# EAGLE design Rev 1 (EAGLE 7.2.0)
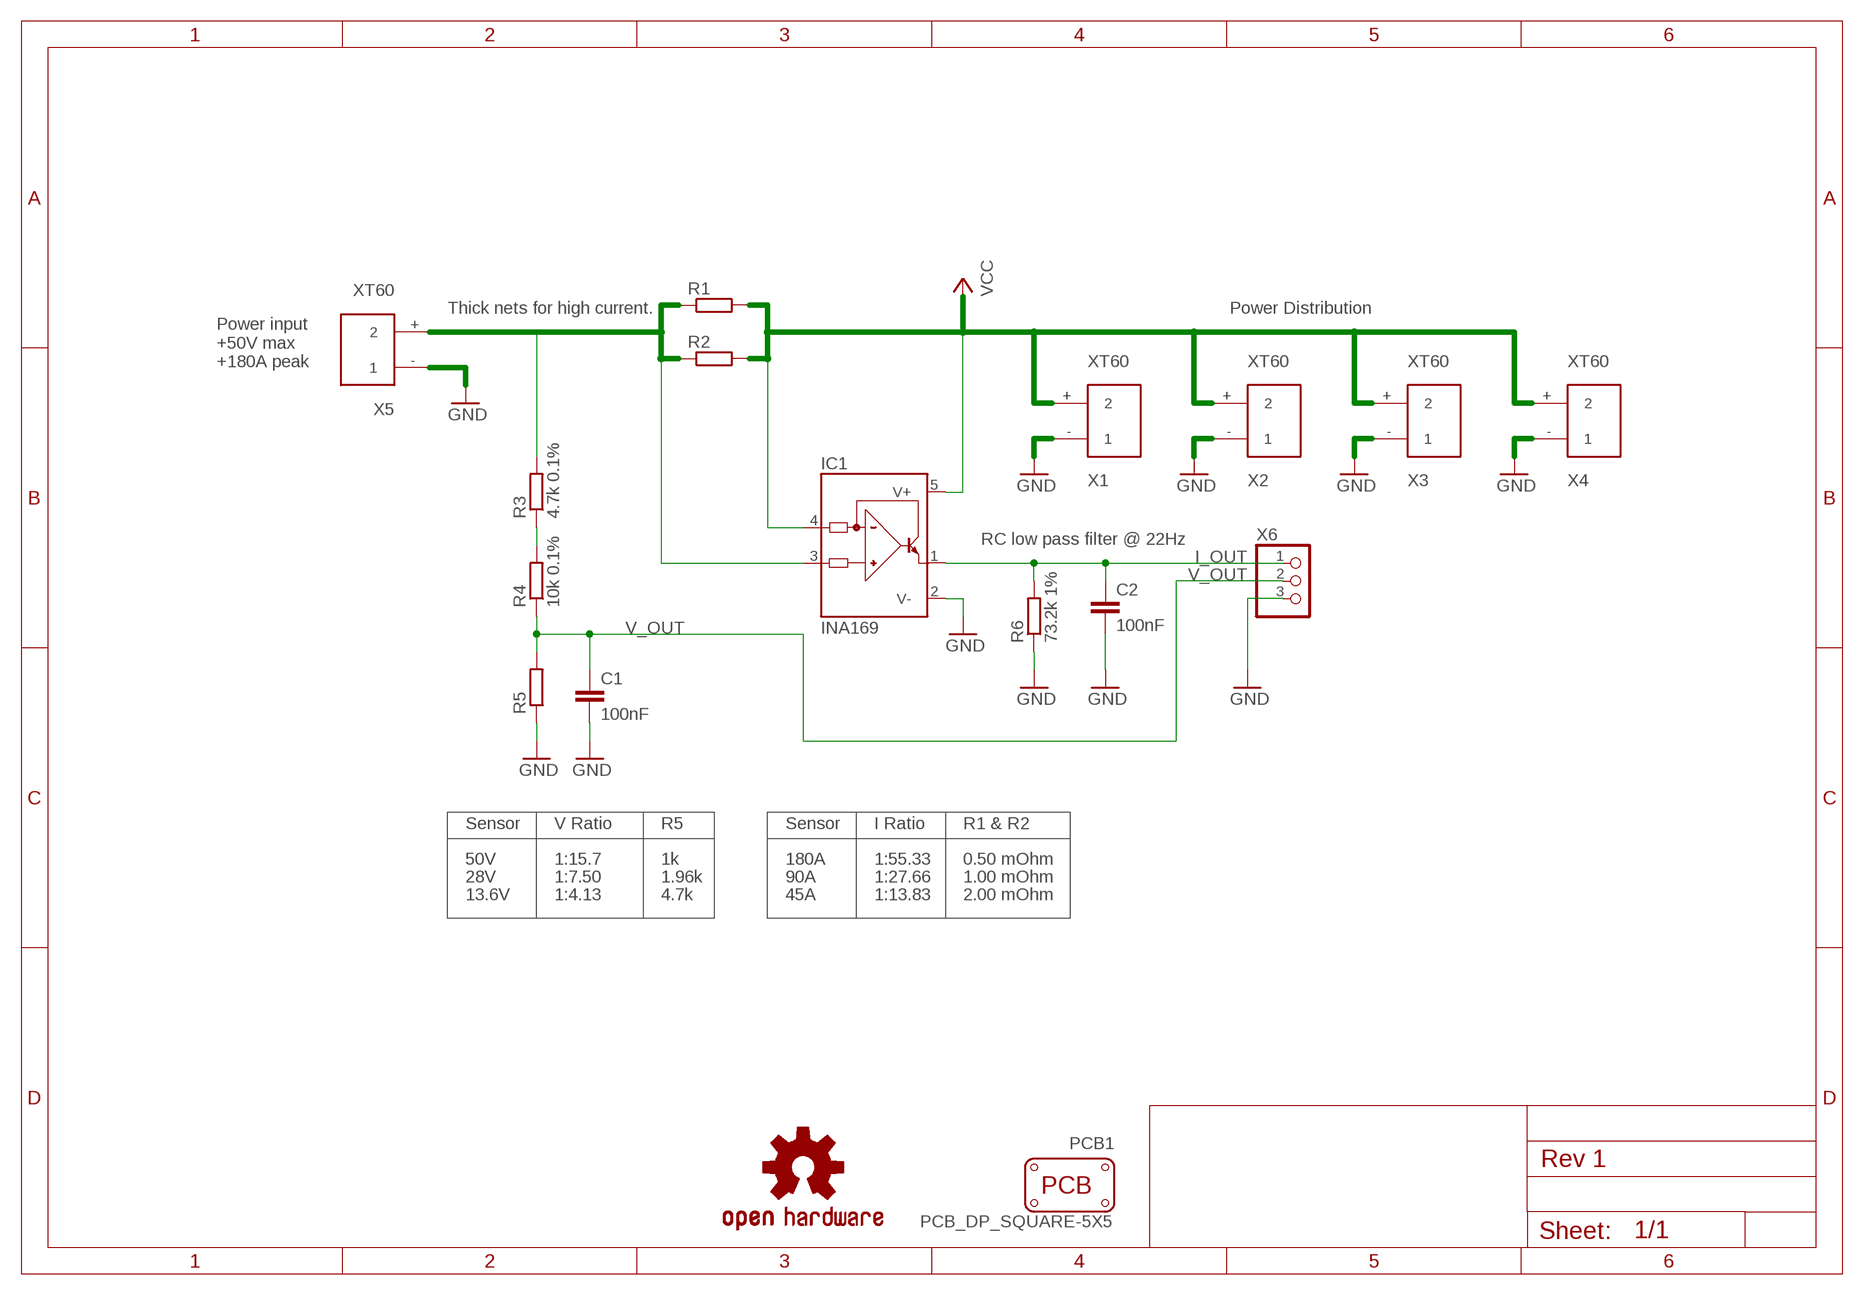
[diagram p0: schematic, sheet 1]

## Parts
C1  100nF  C-EUC0805  [C0805]
C2  100nF  C-EUC0805  [C0805]
IC1  INA169  INA168  [SOT23-5]
LOGO1  OSHW-LOGOL  [OSHW-LOGO-L]
PCB1  PCB_DP_SQUARE-5X5  [DP5050_V1]
R1  R-EU_R2512  [R2512]
R2  R-EU_R2512  [R2512]
R3  4.7k 0.1%  R-EU_R0805  [R0805]
R4  10k 0.1%  R-EU_R0805  [R0805]
R5  R-EU_R0805  [R0805]
R6  73.2k 1%  R-EU_R0805  [R0805]
X1  XT60  [XT60]
X2  XT60  [XT60]
X3  XT60  [XT60]
X4  XT60  [XT60]
X5  XT60  [XT60]
X6  PINHD-1X3  [1X03]

## Nets
GND: C1.2 C2.2 IC1.2(V-) R5.1 R6.1 X1.- X2.- X3.- X4.- X5.- X6.3
I_OUT: C2.1 IC1.1(OUT) R6.2 X6.1
V_OUT: C1.1 R4.1 R5.2 X6.2
V_SEN_HIGH: R3.1 R4.2
VCC: IC1.4(IN-) IC1.5(V+) R1.2 R2.2 X1.+ X2.+ X3.+ X4.+
VCC_RAW: IC1.3(IN+) R1.1 R2.1 R3.2 X5.+

## Notes on the sheet
- Thick nets for high current. | Power Distribution
- Power input
  +50V max
  +180A peak
- RC low pass filter @ 22Hz
- Sensor | V Ratio | R5 | Sensor | I Ratio | R1 & R2
- 50V | 1:15.7 | 1k | 180A | 1:55.33 | 0.50 mOhm
- 28V | 1:7.50 | 1.96k | 90A | 1:27.66 | 1.00 mOhm
- 13.6V | 1:4.13 | 4.7k | 45A | 1:13.83 | 2.00 mOhm

## Library data of the parts
C1 C2 = rcl:C-EU: CAPACITOR, European symbol; MF: AVX; MPN: 02016D104KAT2A; OC_FARNELL: 1657913
IC1 = burr-brown:INA168: High-Side Measurement Current Shunt Monitor; MF: TEXAS INSTRUMENTS; MPN: INA169NA/250G4; OC_FARNELL: 1234749
LOGO1 = SparkFun-Aesthetics:OSHW-LOGO: Open Source Hardware Logo This logo indicates the piece of hardware it is found on incorporates a OSHW license and/or adheres to the definition of open source hardware found here: http://freedomdefined.org/OSHW; OC_FARNELL: unknown
PCB1 = dp_devices:PCB_DP_SQUARE: Dangerous Prototypes Standard Square PCB sizes; OC_FARNELL: unknown
R1 R2 R5 R6 = rcl:R-EU_: RESISTOR, European symbol; OC_FARNELL: unknown
R3 = rcl:R-EU_: RESISTOR, European symbol; MF: SUSUMU; MPN: RR1220P-472-B-T5; OC_FARNELL: 1653308
R4 = rcl:R-EU_: RESISTOR, European symbol; MF: SUSUMU; MPN: RR1220P-103-B-T5; OC_FARNELL: 1653282
X1-X5 = general:XT60; OC_FARNELL: unknown
X6 = pinhead:PINHD-1X3: PIN HEADER; OC_FARNELL: unknown

## Board
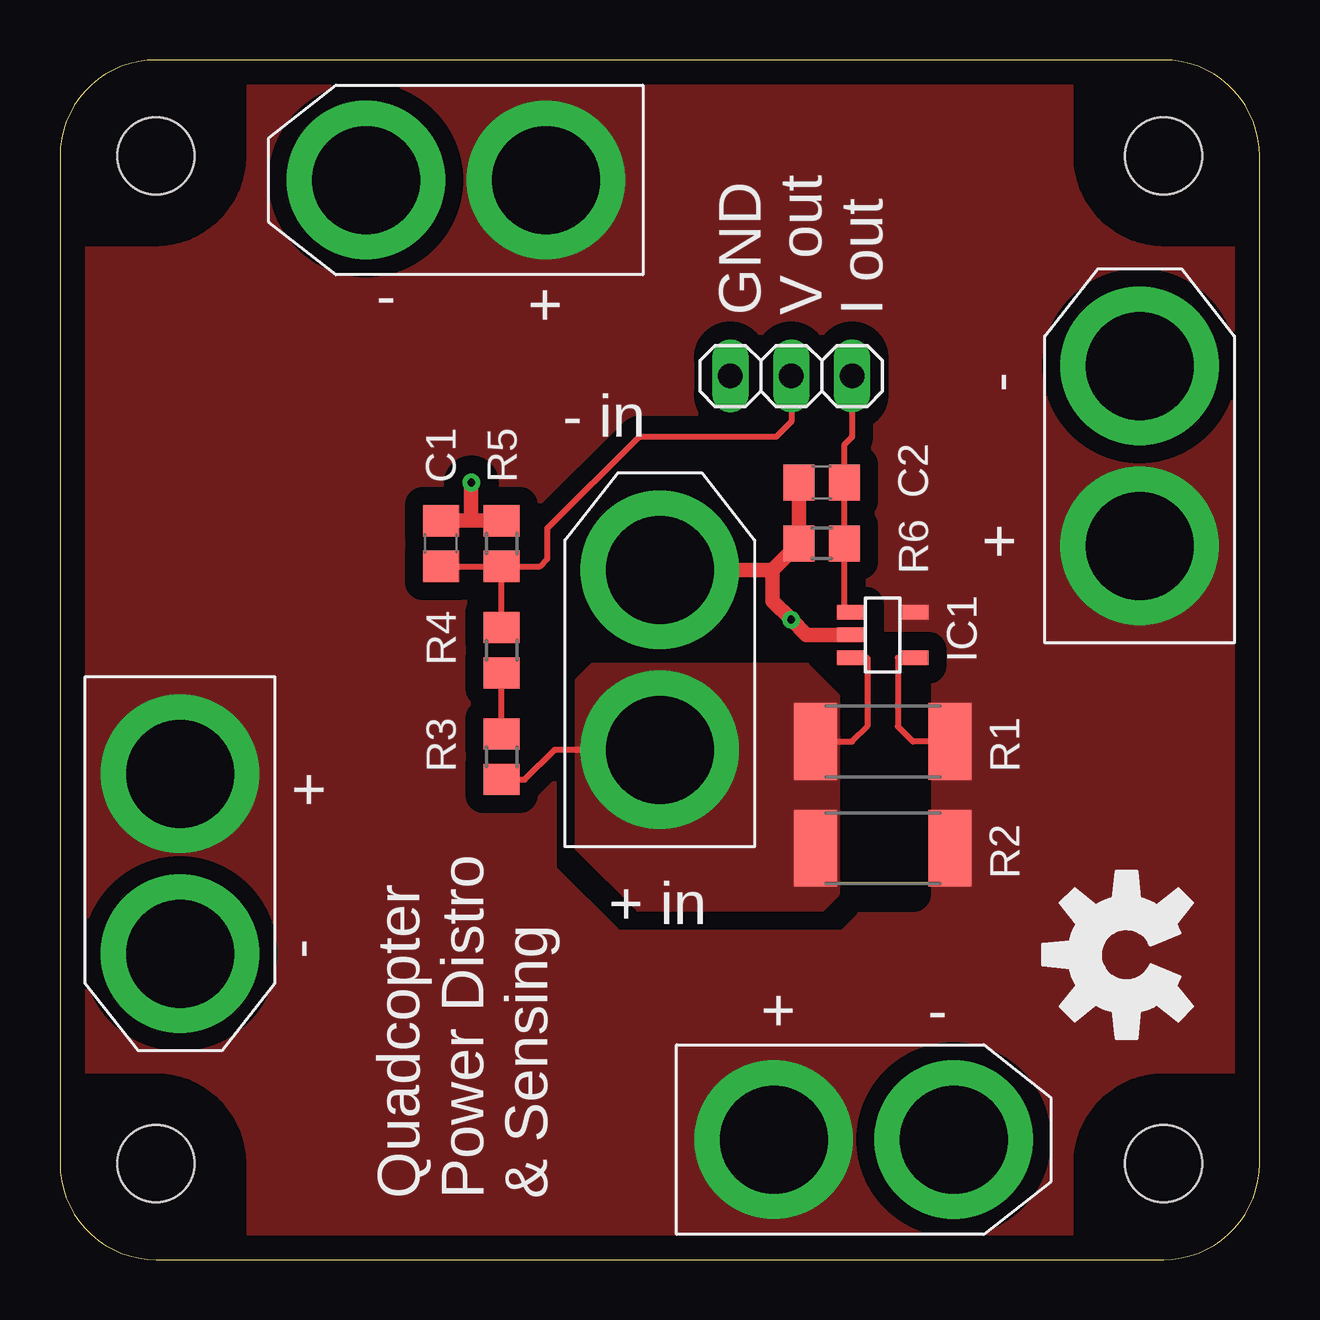
[diagram p1: board, top side]
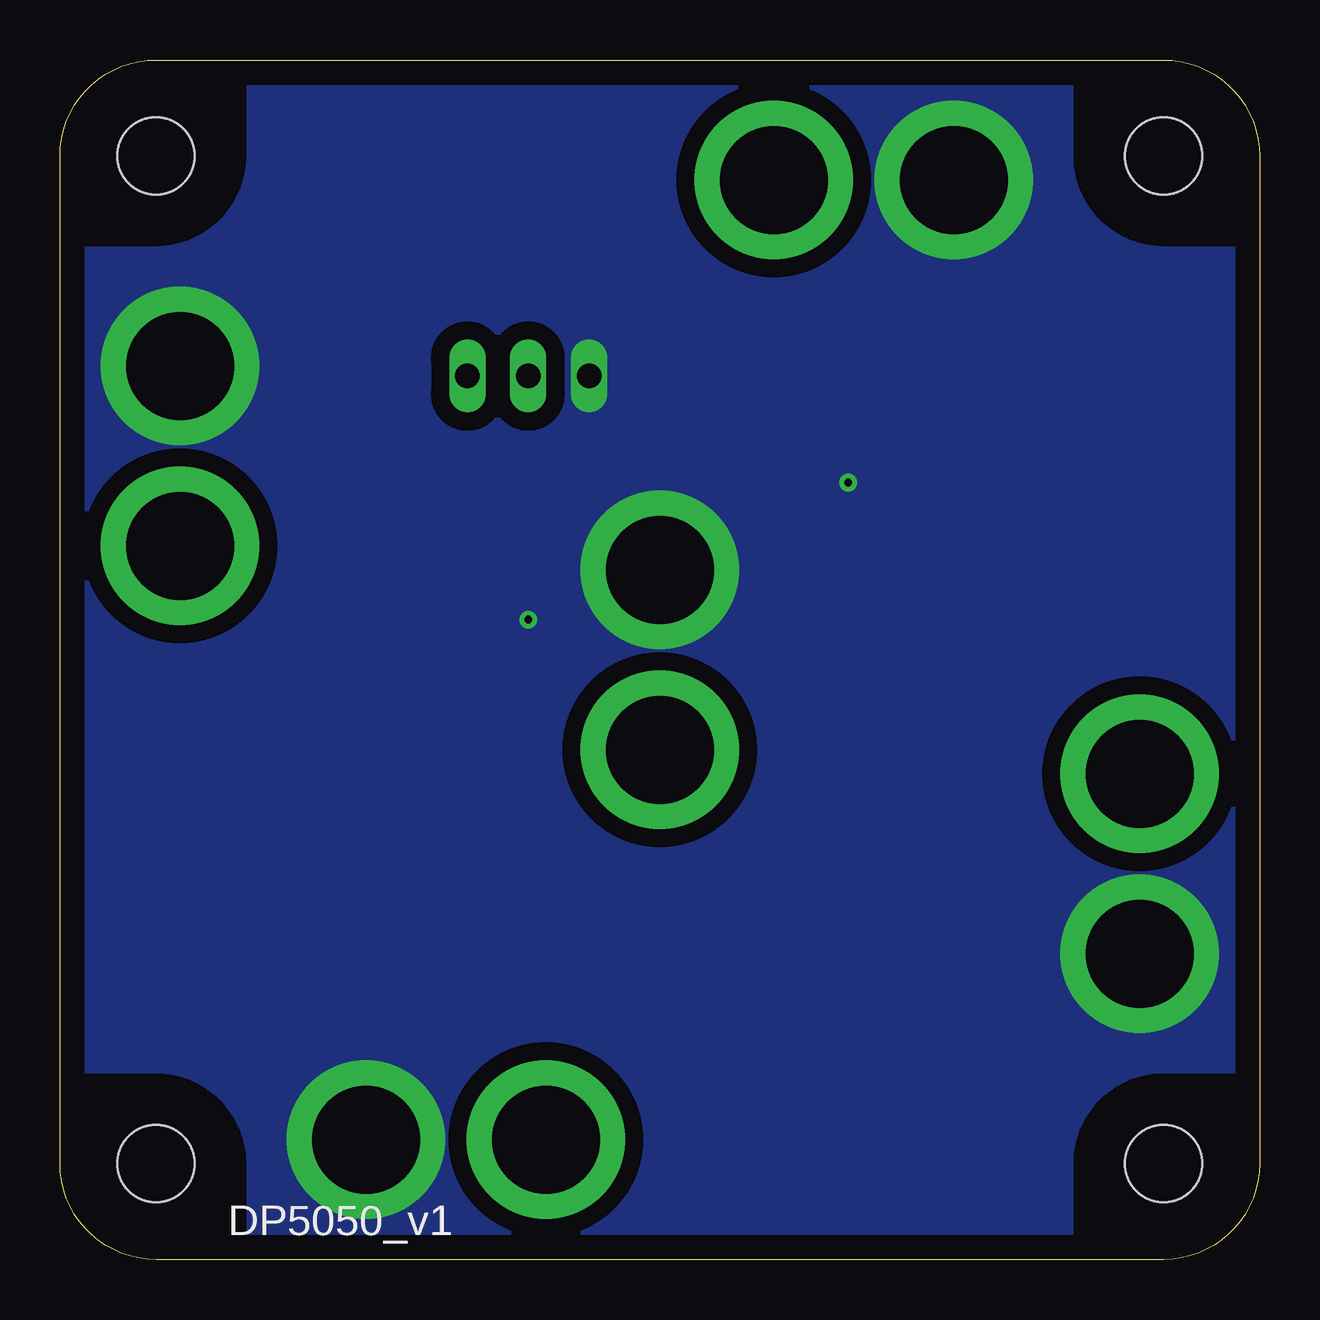
[diagram p2: board, bottom side, seen from below]

Size 50 x 50 mm. Coordinates in mm from the lower left corner, seen from the top.
Copper layers (1*16): Top 0.035mm / dielectric 1.5mm / Bottom 0.035mm
Design rules "default": minimum track width 10mil, minimum drill 24mil, track to track 8mil, track to pad 8mil, pad to pad 8mil, via to via 8mil, smd to smd 8mil, copper to edge 40mil, drill to drill 8mil, minimum pad ring 10mil, minimum via ring 8mil, stop-mask expansion 4mil, vias tented up to drill 0mil, thermal gap 10mil
tRestrict: area 33,15.2 to 35.6,25.4; area 35.6,24.8 to 36.2,25.4

### Footprints (pad centres in the part's own frame; a part is rotated, then mirrored left to right if it is on the bottom)
C0805 = smd 1.3 x 1.5: 1 -0.95,0; 2 0.95,0
SOT23-5 = smd 0.6 x 1.2: 1 -0.95,-1.306; 2 0,-1.306; 3 0.95,-1.306; 4 0.95,1.306; 5 -0.95,1.306
DP5050_V1 = hole 3.2: 4,4; 46,4; 46,46; 4,46
R2512 = smd 1.8 x 3.2: 1 -2.8,0; 2 2.8,0
R0805 = smd 1.3 x 1.5: 1 -0.95,0; 2 0.95,0
XT60 = drill 4.5 pad 6.6: + 3.75,0; - -3.75,0
1X03 = drill 1.016 long: 1 -2.54,0; 2 0,0; 3 2.54,0

### Placement (x,y rotation side)
C1  15.88,29.84 90 top
C2  31.75,32.38 180 top
IC1  34.29,26.04 270 top
LOGO1  44.45,12.7 90 top
PCB1  0,0 0 top
R1  34.29,21.59 0 top
R2  34.29,17.14 0 top
R3  18.41,20.95 270 top
R4  18.41,25.4 270 top
R5  18.41,29.84 270 top
R6  31.75,29.84 0 top
X1  16.5,45 0 top
X2  45,33.5 270 top
X3  33.5,5 180 top
X4  5,16.5 90 top
X5  25,25 270 top
X6  30.48,36.83 180 top

### Tracks (layer width: path | path; a pad name or v marks a point on that pad's centre or on a via)
GND  (via drill 0.33)
  Top 0.61: C1.2 17.14,30.8 | 17.14,30.8 v17.14,32.38 | R5.1 17.14,30.8 | C2.2 R6.1 29.7,28.75 | IC1.2 31.11,26.04 v30.48,26.67 29.7,27.45 29.7,28.75 | X5.- 29.7,28.75
  pour Bottom (isolate 0.762, rank 6, no thermals): 0,50 50,50 50,0 0,0
I_OUT
  Top 0.254: X6.1 33.02,34.29 32.7,33.97 C2.1 R6.2 32.7,27.27 IC1.1
V_OUT
  Top 0.254: R4.1 R5.2 | C1.1 R5.2 | X6.2 30.48,34.92 29.84,34.29 24.13,34.29 20.32,30.48 20.32,29.21 20,28.89 R5.2
V_SEN_HIGH
  Top 0.254: R3.1 R4.2
VCC
  Top 0.254: R1.2 35.56,21.59 34.92,22.23 34.92,25.09 IC1.4
  pour Top (isolate 0.762, rank 2, no thermals): 0,50 50,50 50,34.92 50,34.91 50,0 0,0
VCC_RAW
  Top 0.254: R1.1 33.02,21.59 33.66,22.23 33.66,25.09 IC1.3 | R3.2 19.37,20 20.61,21.25 X5.+
  pour Top (no thermals): 21.59,24.13 22.23,24.77 31.11,24.77 32.38,23.5 32.38,15.24 31.75,14.61 24.13,14.61 21.59,17.14

### Text on the board
tNames: + - | GND | V out | I out | - in | + - | + - | + in | + - | Quadcopter / Power Distro / & Sensing